# EAGLE design LCMeter3 (EAGLE 9.0.1)
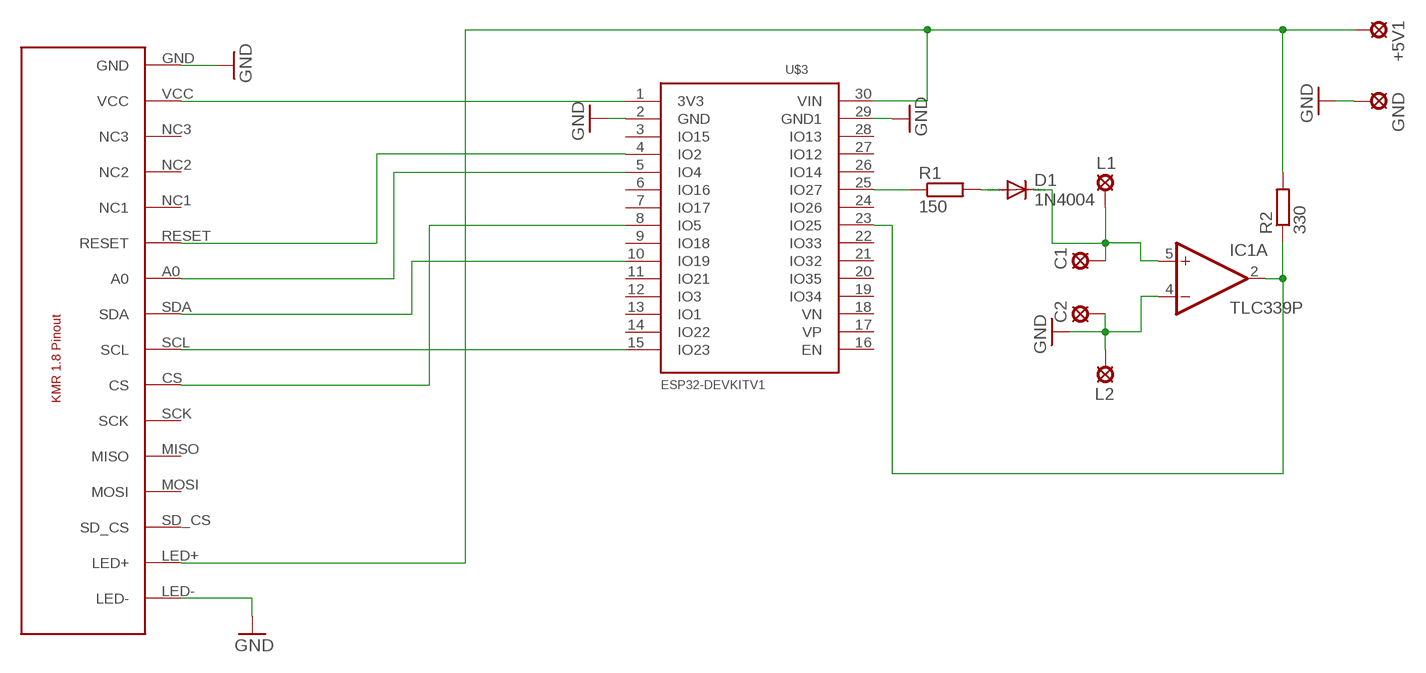
[diagram p0: schematic, sheet 1]

## Parts
+5V1  LSP10  [LSP10]
C1  LSP10  [LSP10]
C2  LSP10  [LSP10]
D1  1N4004  [DO41-10]
GND  LSP10  [LSP10]
IC1  TLC339P  [DIL14]
L1  LSP10  [LSP10]
L2  LSP10  [LSP10]
R1  150  R-EU_0207/10  [0207/10]
R2  330  R-EU_0207/10  [0207/10]
U$3  ESP32DEVKITV1  [ESP32-DEVKITV1]
U$4  KMR-1.8  [KMR-1.8]

## Nets
GND: C2.MP GND.MP IC1.4(A:-IN) L2.MP U$3.2(GND) U$3.29(GND1) U$4.GND U$4.LED-
N$1: D1.A R1.2
N$2: C1.MP D1.C IC1.5(A:+IN) L1.MP
N$5: R1.1 U$3.25(IO27)
N$6: IC1.2(A:OUT) R2.1 U$3.23(IO25)
N$8: U$3.1(3V3) U$4.VCC
N$18: U$3.15(IO23) U$4.SCL
N$20: U$3.10(IO19) U$4.SDA
N$22: U$3.8(IO5) U$4.CS
N$23: U$3.5(IO4) U$4.A0
N$24: U$3.4(IO2) U$4.RESET
V+: +5V1.MP R2.2 U$3.30(VIN) U$4.LED+
Unconnected: IC1.1(B:OUT) IC1.6(B:-IN) IC1.7(B:+IN) IC1.8(C:-IN) IC1.9(C:+IN) IC1.10(D:-IN) IC1.11(D:+IN) IC1.13(D:OUT) IC1.14(C:OUT) U$3.3(IO15) U$3.6(IO16) U$3.7(IO17) U$3.9(IO18) U$3.11(IO21) U$3.12(IO3) U$3.13(IO1) U$3.14(IO22) U$3.16(EN) U$3.17(VP) U$3.18(VN) U$3.19(IO34) U$3.20(IO35) U$3.21(IO32) U$3.22(IO33) U$3.24(IO26) U$3.26(IO14) U$3.27(IO12) U$3.28(IO13) U$4.MISO U$4.MOSI U$4.NC1 U$4.NC2 U$4.NC3 U$4.SCK U$4.SD_CS

## Power pins joined to a net without a drawn wire
GND: IC1.12(P:GND)
V+: IC1.3(P:V+)

## Library data of the parts
+5V1 C1 C2 GND L1 L2 = solpad:LSP10: SOLDER PAD drill 1.0 mm, distributor Buerklin, 12H555
D1 = diode:1N4004: DIODE general purpose rectifier, 1 A
IC1 = linear:TLC339: COMPARATOR
R1 R2 = rcl:R-EU_: RESISTOR, European symbol; SPICEPREFIX: R
U$3 = ESP32-DEVKITV1:ESP32DEVKITV1
U$4 = KMR-1.8:KMR-1.8: KMR-1.8 TFT

## Board
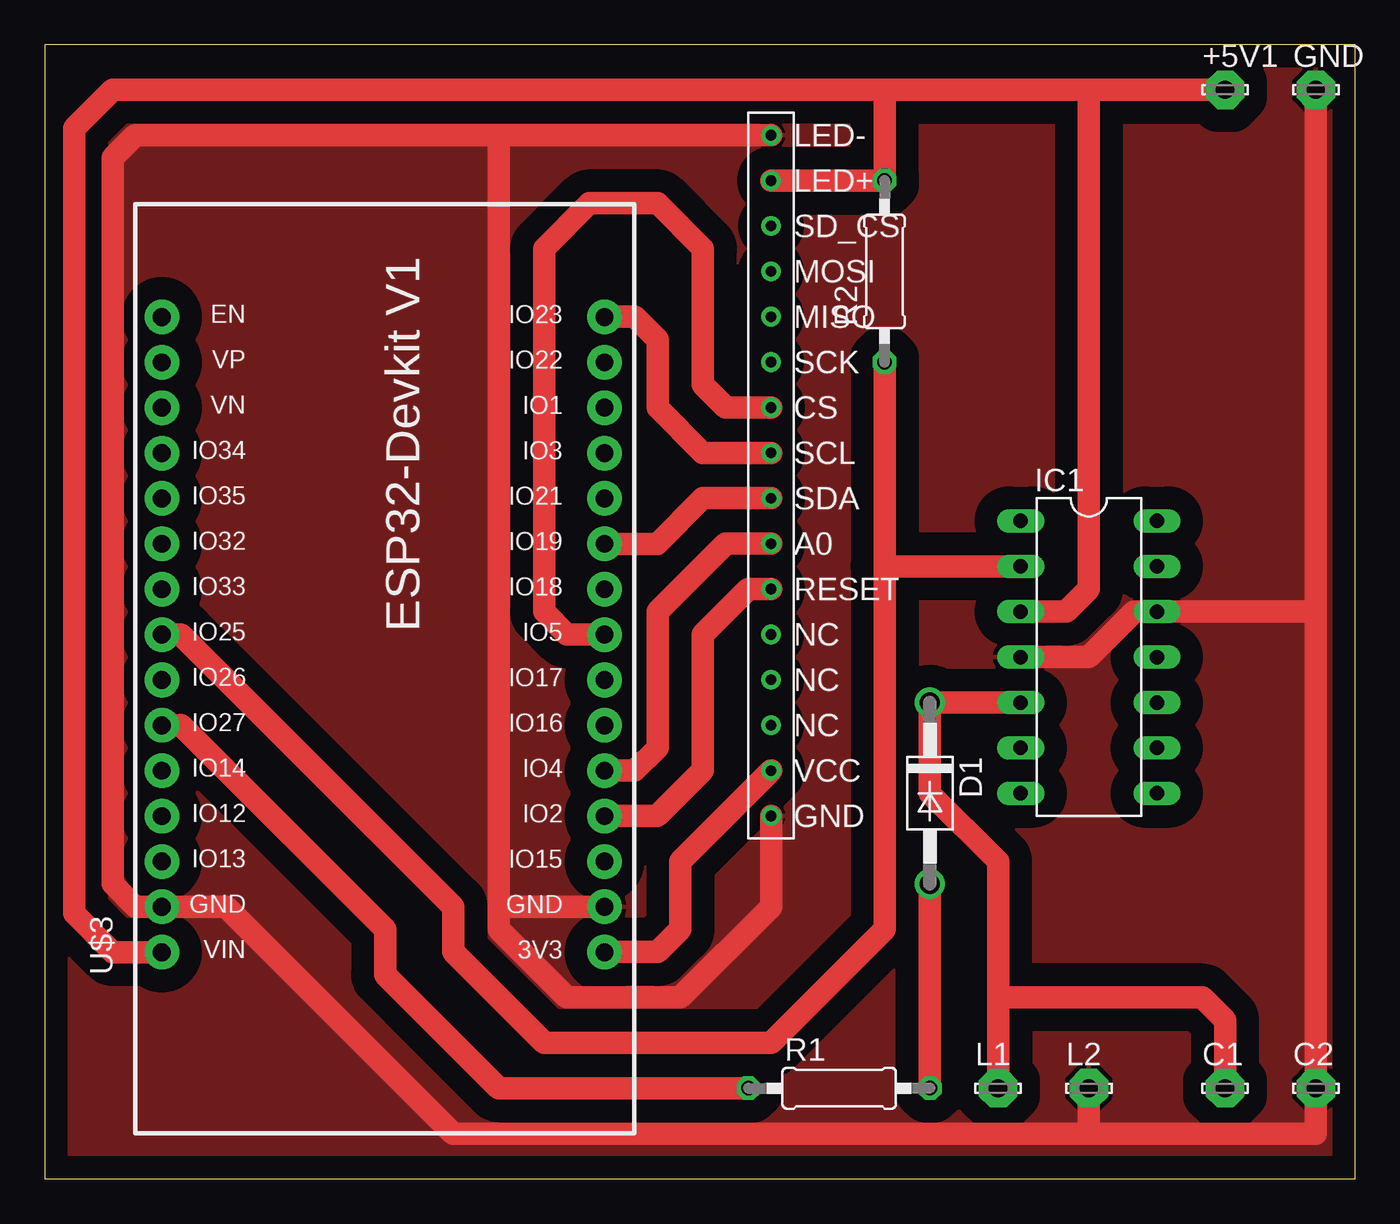
[diagram p1: board, top side]

Size 73.33 x 63.49 mm. Coordinates in mm from the lower left corner, seen from the top.
Outline: 0,0 73.33,0 73.33,63.49 0,63.49 0,0
Copper layers (1*16): Top 0.035mm / dielectric 1.5mm / Bottom 0.035mm
Design rules "default": minimum track width 6mil, minimum drill 0.35mm, track to track 6mil, track to pad 6mil, pad to pad 6mil, via to via 6mil, smd to smd 6mil, copper to edge 40mil, drill to drill 6mil, minimum pad ring 10mil, minimum via ring 8mil, stop-mask expansion 4mil, vias tented up to drill 0mil, thermal gap 10mil

### Footprints (pad centres in the part's own frame; a part is rotated, then mirrored left to right if it is on the bottom)
LSP10 = drill 1.016 pad 2.159 octagon: MP 0,0
DO41-10 = drill 1.118: A 5.08,0; C -5.08,0
DIL14 = drill 0.813 long: 1 -7.62,-3.81; 2 -5.08,-3.81; 3 -2.54,-3.81; 4 0,-3.81; 5 2.54,-3.81; 6 5.08,-3.81; 7 7.62,-3.81; 8 7.62,3.81; 9 5.08,3.81; 10 2.54,3.81; 11 0,3.81; 12 -2.54,3.81; 13 -5.08,3.81; 14 -7.62,3.81
0207/10 = drill 0.813 octagon: 1 -5.08,0; 2 5.08,0
ESP32-DEVKITV1 = drill 1 pad 1.93: 1 -22.87,-13.54; 2 -20.33,-13.54; 3 -17.79,-13.54; 4 -15.25,-13.54; 5 -12.71,-13.54; 6 -10.17,-13.54; 7 -7.63,-13.54; 8 -5.09,-13.54; 9 -2.55,-13.54; 10 -0.01,-13.54; 11 2.53,-13.54; 12 5.07,-13.54; 13 7.61,-13.54; 14 10.15,-13.54; 15 12.69,-13.54; 16 12.69,11.23; 17 10.15,11.23; 18 7.61,11.23; 19 5.07,11.23; 20 2.53,11.23; 21 -0.01,11.23; 22 -2.55,11.23; 23 -5.09,11.23; 24 -7.63,11.23; 25 -10.17,11.23; 26 -12.71,11.23; 27 -15.25,11.23; 28 -17.79,11.23; 29 -20.33,11.23; 30 -22.87,11.23
KMR-1.8 = drill 0.6: A0 -2.54,15.24; CS -2.54,22.86; GND -2.54,0; LED+ -2.54,35.56; LED- -2.54,38.1; MISO -2.54,27.94; MOSI -2.54,30.48; NC1 -2.54,10.16; NC2 -2.54,7.62; NC3 -2.54,5.08; RESET -2.54,12.7; SCK -2.54,25.4; SCL -2.54,20.32; SD_CS -2.54,33.02; SDA -2.54,17.78; VCC -2.54,2.54

### Placement (x,y rotation side)
+5V1  66.04,60.96 0 top
C1  66.04,5.08 0 top
C2  71.12,5.08 0 top
D1  49.53,21.59 270 top
GND  71.12,60.96 0 top
IC1  58.42,29.21 270 top
L1  53.34,5.08 0 top
L2  58.42,5.08 0 top
R1  44.45,5.08 0 top
R2  46.99,50.8 90 top
U$3  17.78,35.56 90 top
U$4  43.18,20.32 0 top

### Tracks (layer width: path | path; a pad name or v marks a point on that pad's centre or on a via)
GND
  Top 1.27: U$3.2 29.2,15.23 29.19,15.24 25.4,15.24 | 25.4,58.42 5.08,58.42 3.81,57.15 3.81,16.51 5.08,15.24 U$3.29 10.16,15.24 22.86,2.54 58.42,2.54 | 25.4,58.42 U$4.LED- | 25.4,15.24 25.4,13.97 29.21,10.16 35.56,10.16 40.64,15.24 U$4.GND | 25.4,15.24 25.4,58.42 | GND.MP 71.12,31.75 | 71.12,31.75 C2.MP 71.12,2.54 58.42,2.54 | L2.MP 58.42,2.54 | IC1.4 58.42,29.21 60.96,31.75 IC1.12 71.12,31.75
  pour Top (isolate 1.27): -1.27,64.77 -1.27,-1.27 74.93,-1.27 74.93,64.77
N$1
  Top 1.27: R1.2 D1.A
N$2
  Top 1.27: 53.34,10.16 64.77,10.16 66.04,8.89 C1.MP | 53.34,10.16 L1.MP | 53.34,10.16 53.34,17.78 49.53,21.59 D1.C IC1.5
N$5
  Top 1.27: U$3.25 7.61,25.39 7.62,25.4 19.05,13.97 19.05,11.43 25.4,5.08 R1.1
N$6
  Top 1.27: U$3.23 7.61,30.47 7.62,30.48 22.86,15.24 22.86,12.7 27.94,7.62 40.64,7.62 46.99,13.97 46.99,34.29 | R2.1 46.99,34.29 | IC1.2 46.99,34.29
N$8
  Top 1.27: U$4.VCC 35.56,17.78 35.56,13.97 34.29,12.7 U$3.1
N$18
  Top 1.27: U$3.15 33.02,48.26 34.29,46.99 34.29,43.18 36.83,40.64 U$4.SCL
N$20
  Top 1.27: U$4.SDA 36.83,38.1 34.28,35.55 U$3.10
N$22
  Top 1.27: U$4.CS 38.1,43.18 36.83,44.45 36.83,52.07 34.29,54.61 30.48,54.61 27.94,52.07 27.94,31.75 29.21,30.48 U$3.8
N$23
  Top 1.27: U$4.A0 38.1,35.56 34.29,31.75 34.29,24.13 33.02,22.86 U$3.5
N$24
  Top 1.27: U$4.RESET 39.37,33.02 36.83,30.48 36.83,22.86 34.28,20.31 U$3.4
V+
  Top 1.27: 58.42,60.96 +5V1.MP | U$3.30 3.82,12.69 1.65,14.86 1.65,58.8 3.81,60.96 46.99,60.96 | 58.42,60.96 58.42,33.02 57.15,31.75 IC1.3 | U$4.LED+ R2.2 46.99,60.96 | 46.99,60.96 58.42,60.96